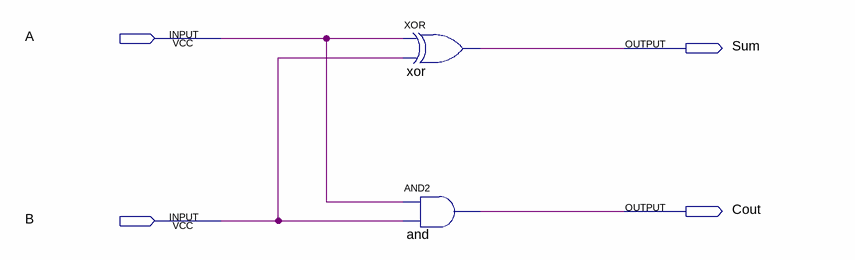
[diagram p0: schematic sheet]
// Quartus schematic half_adder.bdf as structural Verilog: 2 symbols, 4 pins
module half_adder (
  input  A,
  input  B,
  output Sum,
  output Cout
);

  xor \xor  (Sum, A, B);
  and \and  (Cout, A, B);
endmodule
